# Altium schematic sheet LOG_AMP.SchDoc
size A4; SheetNumber: 4; SheetTotal: 6
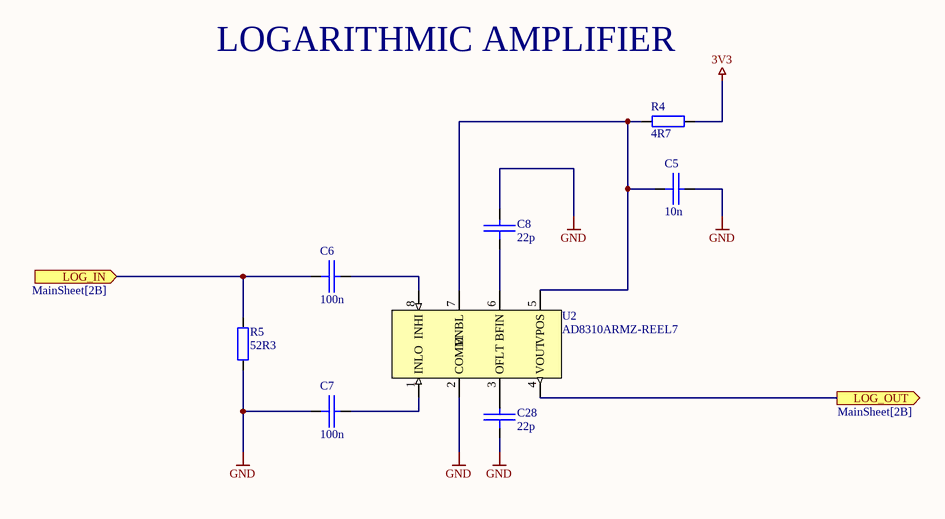
[diagram p0: LOG_AMP.SchDoc]

## Parts
C5  10n  [0805]
C6  100n  [0805]
C7  100n  [0805]
C8  22p  [0402]
C28  22p  [0402]
R4  4R7  [0805]
R5  52R3  [0805]
U2  AD8310ARMZ-REEL7  [MSOP]

## Ports
LOG_IN (in, see MainSheet[2B]), LOG_OUT (out, see MainSheet[2B])

## Nets
3V3: R4.2
GND: C5.2 C7.1 C8.2 C28.1 R5.1 U2.2(COMM)
LOG_IN: C6.1 R5.2 ; port LOG_IN
LOG_OUT: U2.4(VOUT) ; port LOG_OUT
NetC5_1: C5.1 R4.1 U2.5(VPOS) U2.7(ENBL)
NetC6_2: C6.2 U2.8(INHI)
NetC7_2: C7.2 U2.1(INLO)
NetC8_1: C8.1 U2.6(BFIN)
NetC28_2: C28.2 U2.3(OFLT)

## Notes on the sheet
- LOGARITHMIC AMPLIFIER

## Library data of the parts
C5 = C0805C103K5RECAUTO: Kondenzator, C0G, 10%, 50VDC; Manufacturer: KEMET; Capacitance: 10nF; Value: 10nF; Supplier 1: Mouser; Manufacturer Part Number: C0805C103K5RECAUTO; Case/Package: 0805; ComponentLink1Description: http://www.farnell.com/datasheets/2723804.pdf?src-supplier=Farnell; Supplier Part Number 1: 80-C0805C103K5RECAUT; Category: Ceramic Capacitors; Kučište: 0805
C6 C7 = MCJCU21GBB7104KTPA01: Kondenzator, X7R, 10%, 50VDC; Manufacturer: TDK; Manufacturer Part Number: C2012X7R1H104K125AE; Capacitance: 100nF; Value: 100nF; Supplier 1: Mouser; Case/Package: 0805; ComponentLink1Description: https://datasheet.ciiva.com/29534/mlcc-commercial-soft-en-29534235.pdf?src-supplier=Digi-Key; Supplier Part Number 1: 963-MCJCU21GBB7104KT; Category: Ceramic Capacitors; Supplier 2: Mouser; Supplier Part Number 2: 810-C2012X7R1H104KAE; Kučište: 0805
C8 C28 = KAM05ACG1H220FH: Kondenzator, C0G, 1%, 50VDC; Supplier 1: Mouser; Supplier Part Number 1: 581-KAM05ACG1H220FH; Kučište: 0402; Case/Package: 0402
R4 = AC0805FR-074R7L: Otpornik, 1%, 125mW; Manufacturer: Yageo; Value: 4.7; Supplier 1: Mouser; Manufacturer Part Number: AC0805FR-074R7L; Category: Chip SMD Resistors; Case/Package: 0805; ComponentLink1Description: https://datasheet.ciiva.com/12577/pyu-ac-51-rohs-l-2-12577194.pdf?src-supplier=Mouser; Supplier Part Number 1: 603-AC0805FR-074R7L; Kučište: 0805
R5 = RC0805FR-0752R3L: Otpornik, 1%, 125mW; Manufacturer: Yageo; Value: 52.3; Case/Package: 0805; Category: Chip SMD Resistors; Manufacturer Part Number: RC0805FR-0752R3L; Supplier 1: Mouser; Supplier Part Number 1: 603-RC0805FR-0752R3L; Case: 0805; Kučište: *
U2 = AD8310ARMZ-REEL7: Logaritamsko pojačalo; Manufacturer: Analog Devices; Supplier 1: Mouser; Manufacturer Part Number: AD8310ARMZ-REEL7; Category: Amplifiers - Op Amps, Buffer, Instrumentation; Case/Package: MSOP; ComponentLink1Description: https://datasheet.ciiva.com/15128/getdatasheetpartid-243611-15128567.pdf?src-supplier=Verical; Supplier Part Number 1: 584-AD8310ARMZ-R7